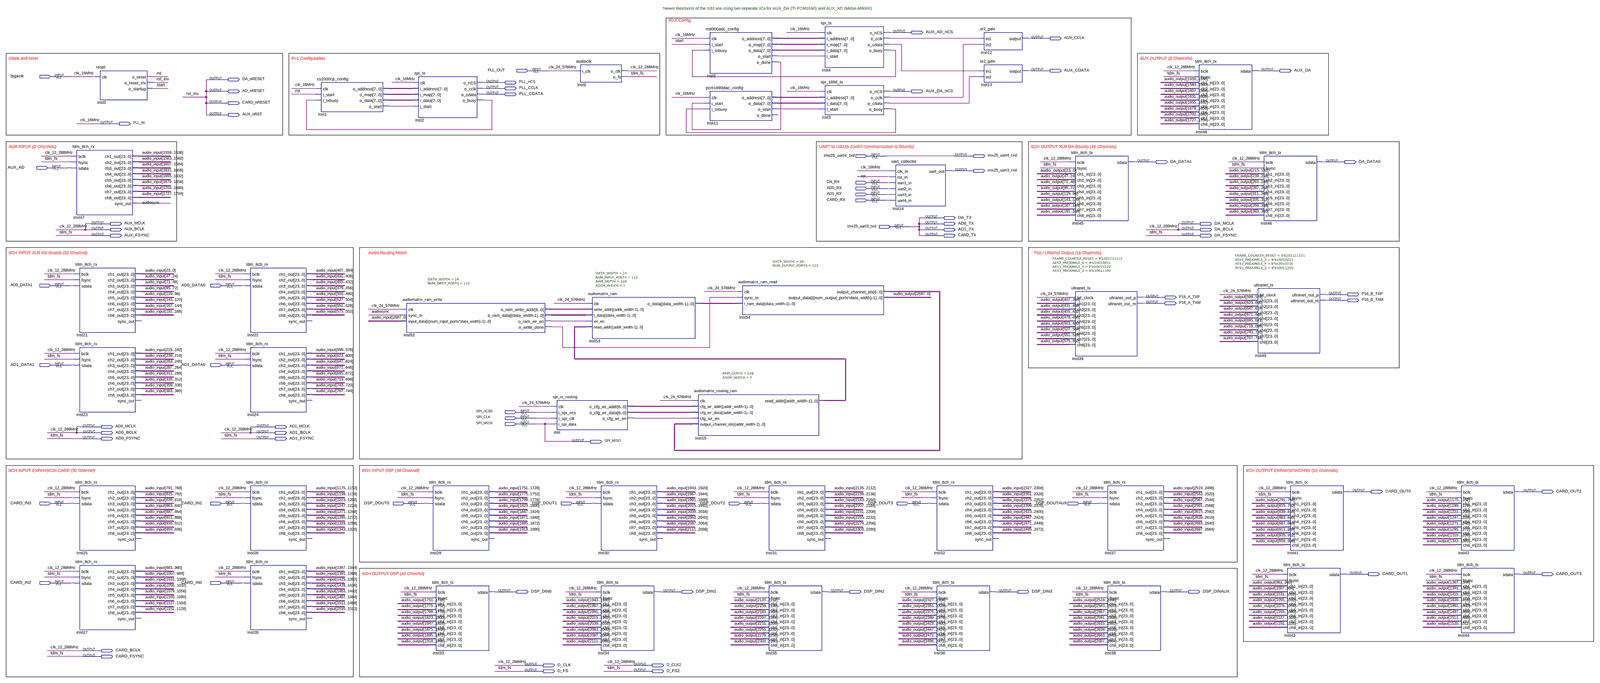
[diagram p0: schematic sheet, whole]
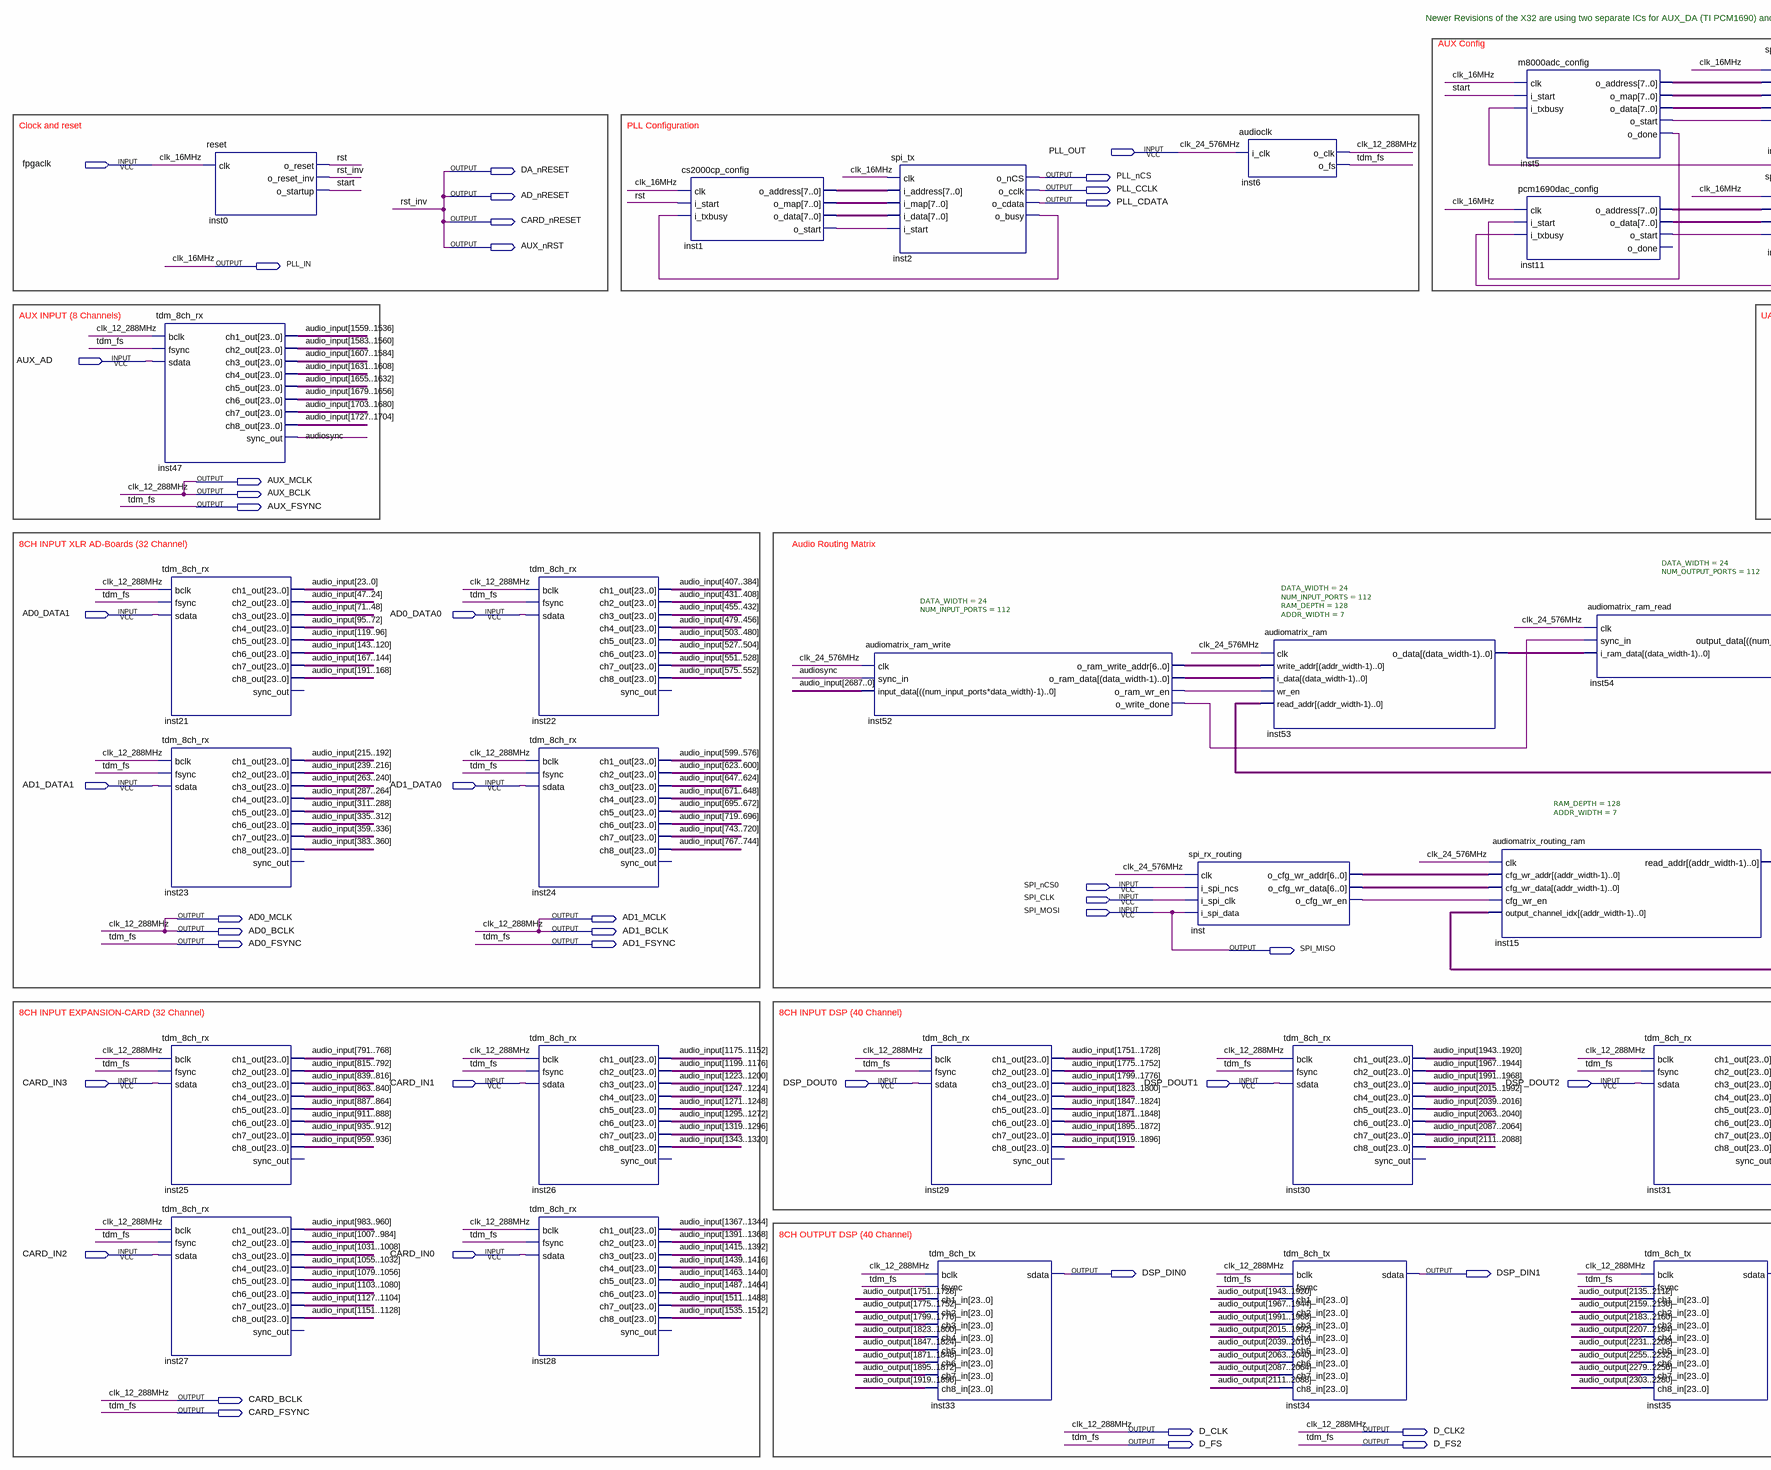
[diagram p1: schematic sheet, left part]
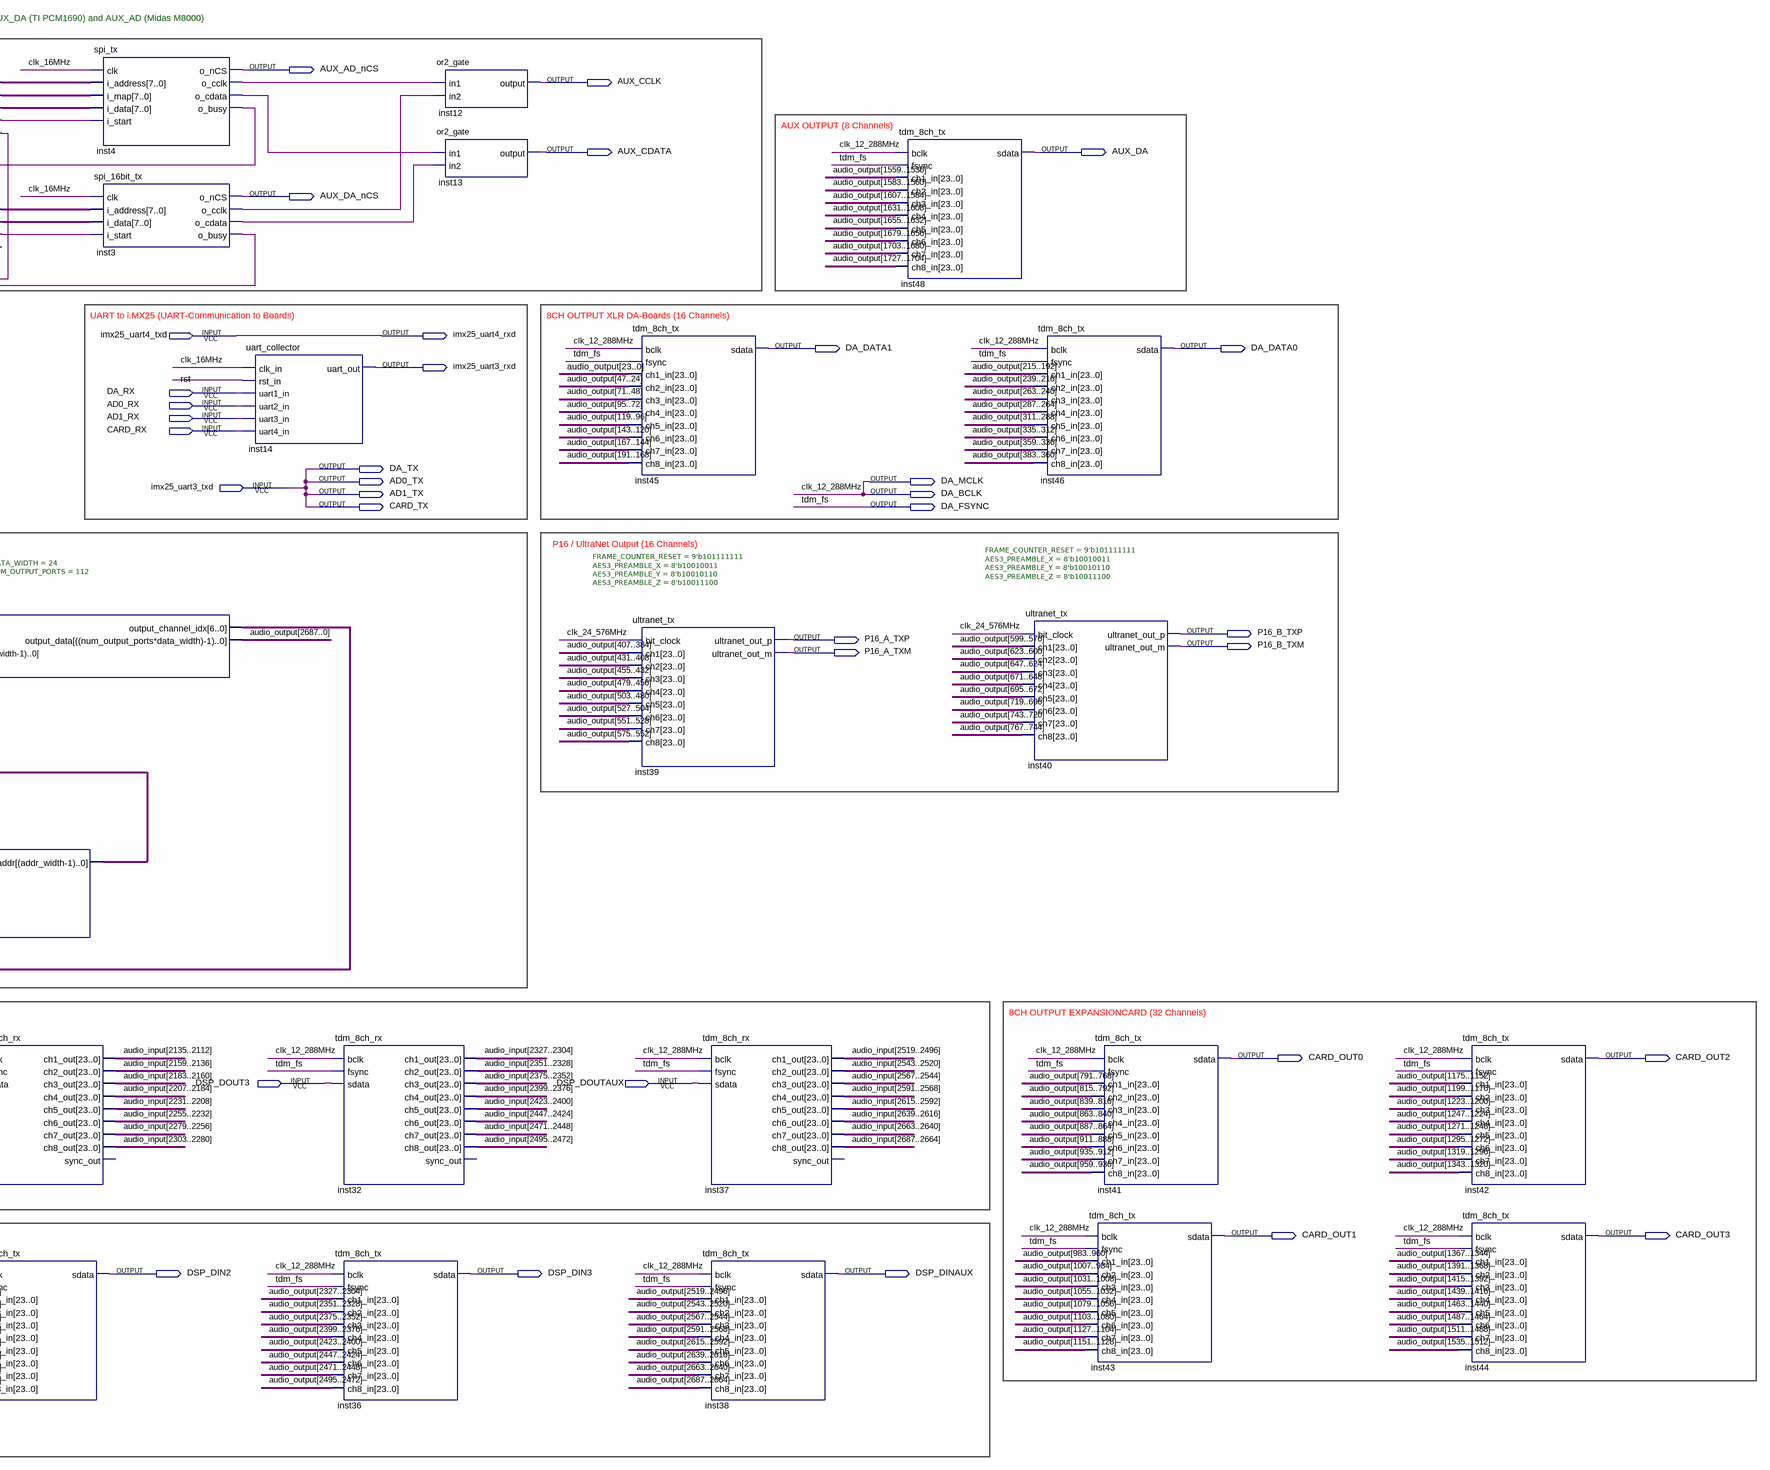
[diagram p2: schematic sheet, right part]
// Quartus schematic main.bdf as structural Verilog: 44 symbols, 78 pins
module main (
  input  PLL_OUT,
  input  fpgaclk,
  input  imx25_uart4_txd,
  input  AUX_AD,
  input  DA_RX,
  input  AD0_RX,
  input  AD1_RX,
  input  CARD_RX,
  input  imx25_uart3_txd,
  input  AD0_DATA1,
  input  AD0_DATA0,
  input  AD1_DATA1,
  input  AD1_DATA0,
  input  SPI_nCS0,
  input  SPI_CLK,
  input  SPI_MOSI,
  input  CARD_IN3,
  input  CARD_IN1,
  input  DSP_DOUT0,
  input  DSP_DOUT1,
  input  DSP_DOUT2,
  input  DSP_DOUT3,
  input  DSP_DOUTAUX,
  input  CARD_IN2,
  input  CARD_IN0,
  output AUX_AD_nCS,
  output AUX_CCLK,
  output AUX_CDATA,
  output AUX_DA,
  output DA_nRESET,
  output PLL_nCS,
  output PLL_CCLK,
  output AD_nRESET,
  output AUX_DA_nCS,
  output PLL_CDATA,
  output CARD_nRESET,
  output AUX_nRST,
  output PLL_IN,
  output imx25_uart4_rxd,
  output DA_DATA1,
  output DA_DATA0,
  output imx25_uart3_rxd,
  output DA_TX,
  output AUX_MCLK,
  output AD0_TX,
  output DA_MCLK,
  output AUX_BCLK,
  output AD1_TX,
  output DA_BCLK,
  output AUX_FSYNC,
  output CARD_TX,
  output DA_FSYNC,
  output P16_B_TXP,
  output P16_A_TXP,
  output P16_B_TXM,
  output P16_A_TXM,
  output AD0_MCLK,
  output AD1_MCLK,
  output AD0_BCLK,
  output AD1_BCLK,
  output AD0_FSYNC,
  output AD1_FSYNC,
  output SPI_MISO,
  output CARD_OUT0,
  output CARD_OUT2,
  output CARD_OUT1,
  output CARD_OUT3,
  output DSP_DIN0,
  output DSP_DIN1,
  output DSP_DIN2,
  output DSP_DIN3,
  output DSP_DINAUX,
  output CARD_BCLK,
  output CARD_FSYNC,
  output D_CLK,
  output D_CLK2,
  output D_FS,
  output D_FS2
);

  wire audiosync, inst1_o_start, inst2_o_busy, inst3_o_busy, inst3_o_cclk, inst3_o_cdata, inst4_o_busy,
       inst4_o_cclk, inst4_o_cdata, inst5_o_done, inst5_o_start, inst11_o_start, inst52_o_ram_wr_en,
       inst52_o_write_done, inst_o_cfg_wr_en, rst, start;
  wire [6:0] inst15_read_addr, inst52_o_ram_write_addr, inst54_output_channel_idx, inst_o_cfg_wr_addr,
       inst_o_cfg_wr_data;
  wire [7:0] inst1_o_address, inst1_o_data, inst1_o_map, inst5_o_address, inst5_o_data, inst5_o_map,
       inst11_o_address, inst11_o_data;
  wire [23:0] inst52_o_ram_data, inst53_o_data;
  wire [2687:0] audio_input, audio_output;

  tdm_8ch_rx inst47 (
    .bclk(AD0_BCLK), .fsync(AD0_FSYNC), .sdata(AUX_AD), .ch1_out(audio_input[1559:1536]),
    .ch2_out(audio_input[1583:1560]), .ch3_out(audio_input[1607:1584]), .ch4_out(audio_input[1631:1608]),
    .ch5_out(audio_input[1655:1632]), .ch6_out(audio_input[1679:1656]), .ch7_out(audio_input[1703:1680]),
    .ch8_out(audio_input[1727:1704]), .sync_out(audiosync));
  tdm_8ch_rx inst21 (
    .bclk(AD0_BCLK), .fsync(AD0_FSYNC), .sdata(AD0_DATA1), .ch1_out(audio_input[23:0]),
    .ch2_out(audio_input[47:24]), .ch3_out(audio_input[71:48]), .ch4_out(audio_input[95:72]),
    .ch5_out(audio_input[119:96]), .ch6_out(audio_input[143:120]), .ch7_out(audio_input[167:144]),
    .ch8_out(audio_input[191:168]));  // open: sync_out
  tdm_8ch_rx inst23 (
    .bclk(AD0_BCLK), .fsync(AD0_FSYNC), .sdata(AD1_DATA1), .ch1_out(audio_input[215:192]),
    .ch2_out(audio_input[239:216]), .ch3_out(audio_input[263:240]), .ch4_out(audio_input[287:264]),
    .ch5_out(audio_input[311:288]), .ch6_out(audio_input[335:312]), .ch7_out(audio_input[359:336]),
    .ch8_out(audio_input[383:360]));  // open: sync_out
  tdm_8ch_rx inst25 (
    .bclk(AD0_BCLK), .fsync(AD0_FSYNC), .sdata(CARD_IN3), .ch1_out(audio_input[791:768]),
    .ch2_out(audio_input[815:792]), .ch3_out(audio_input[839:816]), .ch4_out(audio_input[863:840]),
    .ch5_out(audio_input[887:864]), .ch6_out(audio_input[911:888]), .ch7_out(audio_input[935:912]),
    .ch8_out(audio_input[959:936]));  // open: sync_out
  tdm_8ch_rx inst27 (
    .bclk(AD0_BCLK), .fsync(AD0_FSYNC), .sdata(CARD_IN2), .ch1_out(audio_input[983:960]),
    .ch2_out(audio_input[1007:984]), .ch3_out(audio_input[1031:1008]), .ch4_out(audio_input[1055:1032]),
    .ch5_out(audio_input[1079:1056]), .ch6_out(audio_input[1103:1080]), .ch7_out(audio_input[1127:1104]),
    .ch8_out(audio_input[1151:1128]));  // open: sync_out
  reset inst0 (.clk(fpgaclk), .o_reset(rst), .o_reset_inv(AD_nRESET), .o_startup(start));
  tdm_8ch_rx inst22 (
    .bclk(AD0_BCLK), .fsync(AD0_FSYNC), .sdata(AD0_DATA0), .ch1_out(audio_input[407:384]),
    .ch2_out(audio_input[431:408]), .ch3_out(audio_input[455:432]), .ch4_out(audio_input[479:456]),
    .ch5_out(audio_input[503:480]), .ch6_out(audio_input[527:504]), .ch7_out(audio_input[551:528]),
    .ch8_out(audio_input[575:552]));  // open: sync_out
  tdm_8ch_rx inst24 (
    .bclk(AD0_BCLK), .fsync(AD0_FSYNC), .sdata(AD1_DATA0), .ch1_out(audio_input[599:576]),
    .ch2_out(audio_input[623:600]), .ch3_out(audio_input[647:624]), .ch4_out(audio_input[671:648]),
    .ch5_out(audio_input[695:672]), .ch6_out(audio_input[719:696]), .ch7_out(audio_input[743:720]),
    .ch8_out(audio_input[767:744]));  // open: sync_out
  tdm_8ch_rx inst26 (
    .bclk(AD0_BCLK), .fsync(AD0_FSYNC), .sdata(CARD_IN1), .ch1_out(audio_input[1175:1152]),
    .ch2_out(audio_input[1199:1176]), .ch3_out(audio_input[1223:1200]), .ch4_out(audio_input[1247:1224]),
    .ch5_out(audio_input[1271:1248]), .ch6_out(audio_input[1295:1272]), .ch7_out(audio_input[1319:1296]),
    .ch8_out(audio_input[1343:1320]));  // open: sync_out
  tdm_8ch_rx inst28 (
    .bclk(AD0_BCLK), .fsync(AD0_FSYNC), .sdata(CARD_IN0), .ch1_out(audio_input[1367:1344]),
    .ch2_out(audio_input[1391:1368]), .ch3_out(audio_input[1415:1392]), .ch4_out(audio_input[1439:1416]),
    .ch5_out(audio_input[1463:1440]), .ch6_out(audio_input[1487:1464]), .ch7_out(audio_input[1511:1488]),
    .ch8_out(audio_input[1535:1512]));  // open: sync_out
  cs2000cp_config inst1 (
    .clk(fpgaclk), .i_start(rst), .i_txbusy(inst2_o_busy), .o_address(inst1_o_address), .o_map(inst1_o_map),
    .o_data(inst1_o_data), .o_start(inst1_o_start));
  spi_tx inst2 (
    .clk(fpgaclk), .i_address(inst1_o_address), .i_map(inst1_o_map), .i_data(inst1_o_data),
    .i_start(inst1_o_start), .o_nCS(PLL_nCS), .o_cclk(PLL_CCLK), .o_cdata(PLL_CDATA), .o_busy(inst2_o_busy));
  audiomatrix_ram_write #(.DATA_WIDTH(24), .NUM_INPUT_PORTS(112)) inst52 (
    .clk(PLL_OUT), .sync_in(audiosync), .input_data(audio_input), .o_ram_write_addr(inst52_o_ram_write_addr),
    .o_ram_data(inst52_o_ram_data), .o_ram_wr_en(inst52_o_ram_wr_en), .o_write_done(inst52_o_write_done));
  tdm_8ch_rx inst29 (
    .bclk(AD0_BCLK), .fsync(AD0_FSYNC), .sdata(DSP_DOUT0), .ch1_out(audio_input[1751:1728]),
    .ch2_out(audio_input[1775:1752]), .ch3_out(audio_input[1799:1776]), .ch4_out(audio_input[1823:1800]),
    .ch5_out(audio_input[1847:1824]), .ch6_out(audio_input[1871:1848]), .ch7_out(audio_input[1895:1872]),
    .ch8_out(audio_input[1919:1896]));  // open: sync_out
  tdm_8ch_tx inst33 (
    .bclk(AD0_BCLK), .fsync(AD0_FSYNC), .ch1_in(audio_output[1751:1728]), .ch2_in(audio_output[1775:1752]),
    .ch3_in(audio_output[1799:1776]), .ch4_in(audio_output[1823:1800]), .ch5_in(audio_output[1847:1824]),
    .ch6_in(audio_output[1871:1848]), .ch7_in(audio_output[1895:1872]), .ch8_in(audio_output[1919:1896]),
    .sdata(DSP_DIN0));
  spi_rx_routing inst (
    .clk(PLL_OUT), .i_spi_ncs(SPI_nCS0), .i_spi_clk(SPI_CLK), .i_spi_data(SPI_MOSI),
    .o_cfg_wr_addr(inst_o_cfg_wr_addr), .o_cfg_wr_data(inst_o_cfg_wr_data), .o_cfg_wr_en(inst_o_cfg_wr_en));
  audioclk inst6 (.i_clk(PLL_OUT), .o_clk(AD0_BCLK), .o_fs(AD0_FSYNC));
  audiomatrix_ram #(.DATA_WIDTH(24), .NUM_INPUT_PORTS(112), .RAM_DEPTH(128), .ADDR_WIDTH(7)) inst53 (
    .clk(PLL_OUT), .write_addr(inst52_o_ram_write_addr), .i_data(inst52_o_ram_data),
    .wr_en(inst52_o_ram_wr_en), .read_addr(inst15_read_addr), .o_data(inst53_o_data));
  tdm_8ch_rx inst30 (
    .bclk(AD0_BCLK), .fsync(AD0_FSYNC), .sdata(DSP_DOUT1), .ch1_out(audio_input[1943:1920]),
    .ch2_out(audio_input[1967:1944]), .ch3_out(audio_input[1991:1968]), .ch4_out(audio_input[2015:1992]),
    .ch5_out(audio_input[2039:2016]), .ch6_out(audio_input[2063:2040]), .ch7_out(audio_input[2087:2064]),
    .ch8_out(audio_input[2111:2088]));  // open: sync_out
  tdm_8ch_tx inst34 (
    .bclk(AD0_BCLK), .fsync(AD0_FSYNC), .ch1_in(audio_output[1943:1920]), .ch2_in(audio_output[1967:1944]),
    .ch3_in(audio_output[1991:1968]), .ch4_in(audio_output[2015:1992]), .ch5_in(audio_output[2039:2016]),
    .ch6_in(audio_output[2063:2040]), .ch7_in(audio_output[2087:2064]), .ch8_in(audio_output[2111:2088]),
    .sdata(DSP_DIN1));
  audiomatrix_routing_ram #(.RAM_DEPTH(128), .ADDR_WIDTH(7)) inst15 (
    .clk(PLL_OUT), .cfg_wr_addr(inst_o_cfg_wr_addr), .cfg_wr_data(inst_o_cfg_wr_data),
    .cfg_wr_en(inst_o_cfg_wr_en), .output_channel_idx(inst54_output_channel_idx), .read_addr(inst15_read_addr));
  m8000adc_config inst5 (
    .clk(fpgaclk), .i_start(start), .i_txbusy(inst4_o_busy), .o_address(inst5_o_address),
    .o_map(inst5_o_map), .o_data(inst5_o_data), .o_start(inst5_o_start), .o_done(inst5_o_done));
  pcm1690dac_config inst11 (
    .clk(fpgaclk), .i_start(inst5_o_done), .i_txbusy(inst3_o_busy), .o_address(inst11_o_address),
    .o_data(inst11_o_data), .o_start(inst11_o_start));  // open: o_done
  audiomatrix_ram_read #(.DATA_WIDTH(24), .NUM_OUTPUT_PORTS(112)) inst54 (
    .clk(PLL_OUT), .sync_in(inst52_o_write_done), .i_ram_data(inst53_o_data),
    .output_channel_idx(inst54_output_channel_idx), .output_data(audio_output));
  tdm_8ch_rx inst31 (
    .bclk(AD0_BCLK), .fsync(AD0_FSYNC), .sdata(DSP_DOUT2), .ch1_out(audio_input[2135:2112]),
    .ch2_out(audio_input[2159:2136]), .ch3_out(audio_input[2183:2160]), .ch4_out(audio_input[2207:2184]),
    .ch5_out(audio_input[2231:2208]), .ch6_out(audio_input[2255:2232]), .ch7_out(audio_input[2279:2256]),
    .ch8_out(audio_input[2303:2280]));  // open: sync_out
  tdm_8ch_tx inst35 (
    .bclk(AD0_BCLK), .fsync(AD0_FSYNC), .ch1_in(audio_output[2135:2112]), .ch2_in(audio_output[2159:2136]),
    .ch3_in(audio_output[2183:2160]), .ch4_in(audio_output[2207:2184]), .ch5_in(audio_output[2231:2208]),
    .ch6_in(audio_output[2255:2232]), .ch7_in(audio_output[2279:2256]), .ch8_in(audio_output[2303:2280]),
    .sdata(DSP_DIN2));
  spi_tx inst4 (
    .clk(fpgaclk), .i_address(inst5_o_address), .i_map(inst5_o_map), .i_data(inst5_o_data),
    .i_start(inst5_o_start), .o_nCS(AUX_AD_nCS), .o_cclk(inst4_o_cclk), .o_cdata(inst4_o_cdata),
    .o_busy(inst4_o_busy));
  spi_16bit_tx inst3 (
    .clk(fpgaclk), .i_address(inst11_o_address), .i_data(inst11_o_data), .i_start(inst11_o_start),
    .o_nCS(AUX_DA_nCS), .o_cclk(inst3_o_cclk), .o_cdata(inst3_o_cdata), .o_busy(inst3_o_busy));
  uart_collector inst14 (
    .clk_in(fpgaclk), .rst_in(rst), .uart1_in(DA_RX), .uart2_in(AD0_RX), .uart3_in(AD1_RX),
    .uart4_in(CARD_RX), .uart_out(imx25_uart3_rxd));
  tdm_8ch_rx inst32 (
    .bclk(AD0_BCLK), .fsync(AD0_FSYNC), .sdata(DSP_DOUT3), .ch1_out(audio_input[2327:2304]),
    .ch2_out(audio_input[2351:2328]), .ch3_out(audio_input[2375:2352]), .ch4_out(audio_input[2399:2376]),
    .ch5_out(audio_input[2423:2400]), .ch6_out(audio_input[2447:2424]), .ch7_out(audio_input[2471:2448]),
    .ch8_out(audio_input[2495:2472]));  // open: sync_out
  tdm_8ch_tx inst36 (
    .bclk(AD0_BCLK), .fsync(AD0_FSYNC), .ch1_in(audio_output[2327:2304]), .ch2_in(audio_output[2351:2328]),
    .ch3_in(audio_output[2375:2352]), .ch4_in(audio_output[2399:2376]), .ch5_in(audio_output[2423:2400]),
    .ch6_in(audio_output[2447:2424]), .ch7_in(audio_output[2471:2448]), .ch8_in(audio_output[2495:2472]),
    .sdata(DSP_DIN3));
  or2_gate inst12 (.in1(inst4_o_cclk), .in2(inst3_o_cclk), .\output (AUX_CCLK));
  or2_gate inst13 (.in1(inst4_o_cdata), .in2(inst3_o_cdata), .\output (AUX_CDATA));
  tdm_8ch_tx inst45 (
    .bclk(AD0_BCLK), .fsync(AD0_FSYNC), .ch1_in(audio_output[23:0]), .ch2_in(audio_output[47:24]),
    .ch3_in(audio_output[71:48]), .ch4_in(audio_output[95:72]), .ch5_in(audio_output[119:96]),
    .ch6_in(audio_output[143:120]), .ch7_in(audio_output[167:144]), .ch8_in(audio_output[191:168]),
    .sdata(DA_DATA1));
  ultranet_tx #(.FRAME_COUNTER_RESET(9'b101111111), .AES3_PREAMBLE_X(8'b10010011), .AES3_PREAMBLE_Y(8'b10010110), .AES3_PREAMBLE_Z(8'b10011100)) inst39 (
    .bit_clock(PLL_OUT), .ch1(audio_output[407:384]), .ch2(audio_output[431:408]),
    .ch3(audio_output[455:432]), .ch4(audio_output[479:456]), .ch5(audio_output[503:480]),
    .ch6(audio_output[527:504]), .ch7(audio_output[551:528]), .ch8(audio_output[575:552]),
    .ultranet_out_p(P16_A_TXP), .ultranet_out_m(P16_A_TXM));
  tdm_8ch_rx inst37 (
    .bclk(AD0_BCLK), .fsync(AD0_FSYNC), .sdata(DSP_DOUTAUX), .ch1_out(audio_input[2519:2496]),
    .ch2_out(audio_input[2543:2520]), .ch3_out(audio_input[2567:2544]), .ch4_out(audio_input[2591:2568]),
    .ch5_out(audio_input[2615:2592]), .ch6_out(audio_input[2639:2616]), .ch7_out(audio_input[2663:2640]),
    .ch8_out(audio_input[2687:2664]));  // open: sync_out
  tdm_8ch_tx inst38 (
    .bclk(AD0_BCLK), .fsync(AD0_FSYNC), .ch1_in(audio_output[2519:2496]), .ch2_in(audio_output[2543:2520]),
    .ch3_in(audio_output[2567:2544]), .ch4_in(audio_output[2591:2568]), .ch5_in(audio_output[2615:2592]),
    .ch6_in(audio_output[2639:2616]), .ch7_in(audio_output[2663:2640]), .ch8_in(audio_output[2687:2664]),
    .sdata(DSP_DINAUX));
  tdm_8ch_tx inst48 (
    .bclk(AD0_BCLK), .fsync(AD0_FSYNC), .ch1_in(audio_output[1559:1536]), .ch2_in(audio_output[1583:1560]),
    .ch3_in(audio_output[1607:1584]), .ch4_in(audio_output[1631:1608]), .ch5_in(audio_output[1655:1632]),
    .ch6_in(audio_output[1679:1656]), .ch7_in(audio_output[1703:1680]), .ch8_in(audio_output[1727:1704]),
    .sdata(AUX_DA));
  tdm_8ch_tx inst46 (
    .bclk(AD0_BCLK), .fsync(AD0_FSYNC), .ch1_in(audio_output[215:192]), .ch2_in(audio_output[239:216]),
    .ch3_in(audio_output[263:240]), .ch4_in(audio_output[287:264]), .ch5_in(audio_output[311:288]),
    .ch6_in(audio_output[335:312]), .ch7_in(audio_output[359:336]), .ch8_in(audio_output[383:360]),
    .sdata(DA_DATA0));
  ultranet_tx #(.FRAME_COUNTER_RESET(9'b101111111), .AES3_PREAMBLE_X(8'b10010011), .AES3_PREAMBLE_Y(8'b10010110), .AES3_PREAMBLE_Z(8'b10011100)) inst40 (
    .bit_clock(PLL_OUT), .ch1(audio_output[599:576]), .ch2(audio_output[623:600]),
    .ch3(audio_output[647:624]), .ch4(audio_output[671:648]), .ch5(audio_output[695:672]),
    .ch6(audio_output[719:696]), .ch7(audio_output[743:720]), .ch8(audio_output[767:744]),
    .ultranet_out_p(P16_B_TXP), .ultranet_out_m(P16_B_TXM));
  tdm_8ch_tx inst41 (
    .bclk(AD0_BCLK), .fsync(AD0_FSYNC), .ch1_in(audio_output[791:768]), .ch2_in(audio_output[815:792]),
    .ch3_in(audio_output[839:816]), .ch4_in(audio_output[863:840]), .ch5_in(audio_output[887:864]),
    .ch6_in(audio_output[911:888]), .ch7_in(audio_output[935:912]), .ch8_in(audio_output[959:936]),
    .sdata(CARD_OUT0));
  tdm_8ch_tx inst43 (
    .bclk(AD0_BCLK), .fsync(AD0_FSYNC), .ch1_in(audio_output[983:960]), .ch2_in(audio_output[1007:984]),
    .ch3_in(audio_output[1031:1008]), .ch4_in(audio_output[1055:1032]), .ch5_in(audio_output[1079:1056]),
    .ch6_in(audio_output[1103:1080]), .ch7_in(audio_output[1127:1104]), .ch8_in(audio_output[1151:1128]),
    .sdata(CARD_OUT1));
  tdm_8ch_tx inst42 (
    .bclk(AD0_BCLK), .fsync(AD0_FSYNC), .ch1_in(audio_output[1175:1152]), .ch2_in(audio_output[1199:1176]),
    .ch3_in(audio_output[1223:1200]), .ch4_in(audio_output[1247:1224]), .ch5_in(audio_output[1271:1248]),
    .ch6_in(audio_output[1295:1272]), .ch7_in(audio_output[1319:1296]), .ch8_in(audio_output[1343:1320]),
    .sdata(CARD_OUT2));
  tdm_8ch_tx inst44 (
    .bclk(AD0_BCLK), .fsync(AD0_FSYNC), .ch1_in(audio_output[1367:1344]), .ch2_in(audio_output[1391:1368]),
    .ch3_in(audio_output[1415:1392]), .ch4_in(audio_output[1439:1416]), .ch5_in(audio_output[1463:1440]),
    .ch6_in(audio_output[1487:1464]), .ch7_in(audio_output[1511:1488]), .ch8_in(audio_output[1535:1512]),
    .sdata(CARD_OUT3));

  assign AD0_MCLK = AD0_BCLK;
  assign AD0_TX = imx25_uart3_txd;
  assign AD1_BCLK = AD0_BCLK;
  assign AD1_FSYNC = AD0_FSYNC;
  assign AD1_MCLK = AD0_BCLK;
  assign AD1_TX = imx25_uart3_txd;
  assign AUX_BCLK = AD0_BCLK;
  assign AUX_FSYNC = AD0_FSYNC;
  assign AUX_MCLK = AD0_BCLK;
  assign AUX_nRST = AD_nRESET;
  assign CARD_BCLK = AD0_BCLK;
  assign CARD_FSYNC = AD0_FSYNC;
  assign CARD_nRESET = AD_nRESET;
  assign CARD_TX = imx25_uart3_txd;
  assign D_CLK = AD0_BCLK;
  assign D_CLK2 = AD0_BCLK;
  assign D_FS = AD0_FSYNC;
  assign D_FS2 = AD0_FSYNC;
  assign DA_BCLK = AD0_BCLK;
  assign DA_FSYNC = AD0_FSYNC;
  assign DA_MCLK = AD0_BCLK;
  assign DA_nRESET = AD_nRESET;
  assign DA_TX = imx25_uart3_txd;
  assign imx25_uart4_rxd = imx25_uart4_txd;
  assign PLL_IN = fpgaclk;
  assign SPI_MISO = SPI_MOSI;

  // Other names for the same wires on the sheet: rst_inv = AD_nRESET; clk_16MHz = fpgaclk; clk_24_576MHz = PLL_OUT;
  //   clk_12_288MHz = AD0_BCLK; tdm_fs = AD0_FSYNC

  // Notes on the sheet:
  //   Newer Revisions of the X32 are using two separate ICs for AUX_DA (TI PCM1690) and AUX_AD (Midas M8000)
  //   AUX Config
  //   Clock and reset
  //   PLL Configuration
  //   AUX OUTPUT (8 Channels)
  //   AUX INPUT (8 Channels)
  //   UART to i.MX25 (UART-Communication to Boards)
  //   8CH OUTPUT XLR DA-Boards (16 Channels)
  //   8CH INPUT XLR AD-Boards (32 Channel)
  //   Audio Routing Matrix
  //   P16 / UltraNet Output (16 Channels)
  //   8CH INPUT EXPANSION-CARD (32 Channel)
  //   8CH INPUT DSP (40 Channel)
  //   8CH OUTPUT EXPANSIONCARD (32 Channels)
  //   8CH OUTPUT DSP (40 Channel)
endmodule
